# EAGLE design m4_Dev_Board (EAGLE 6.2)
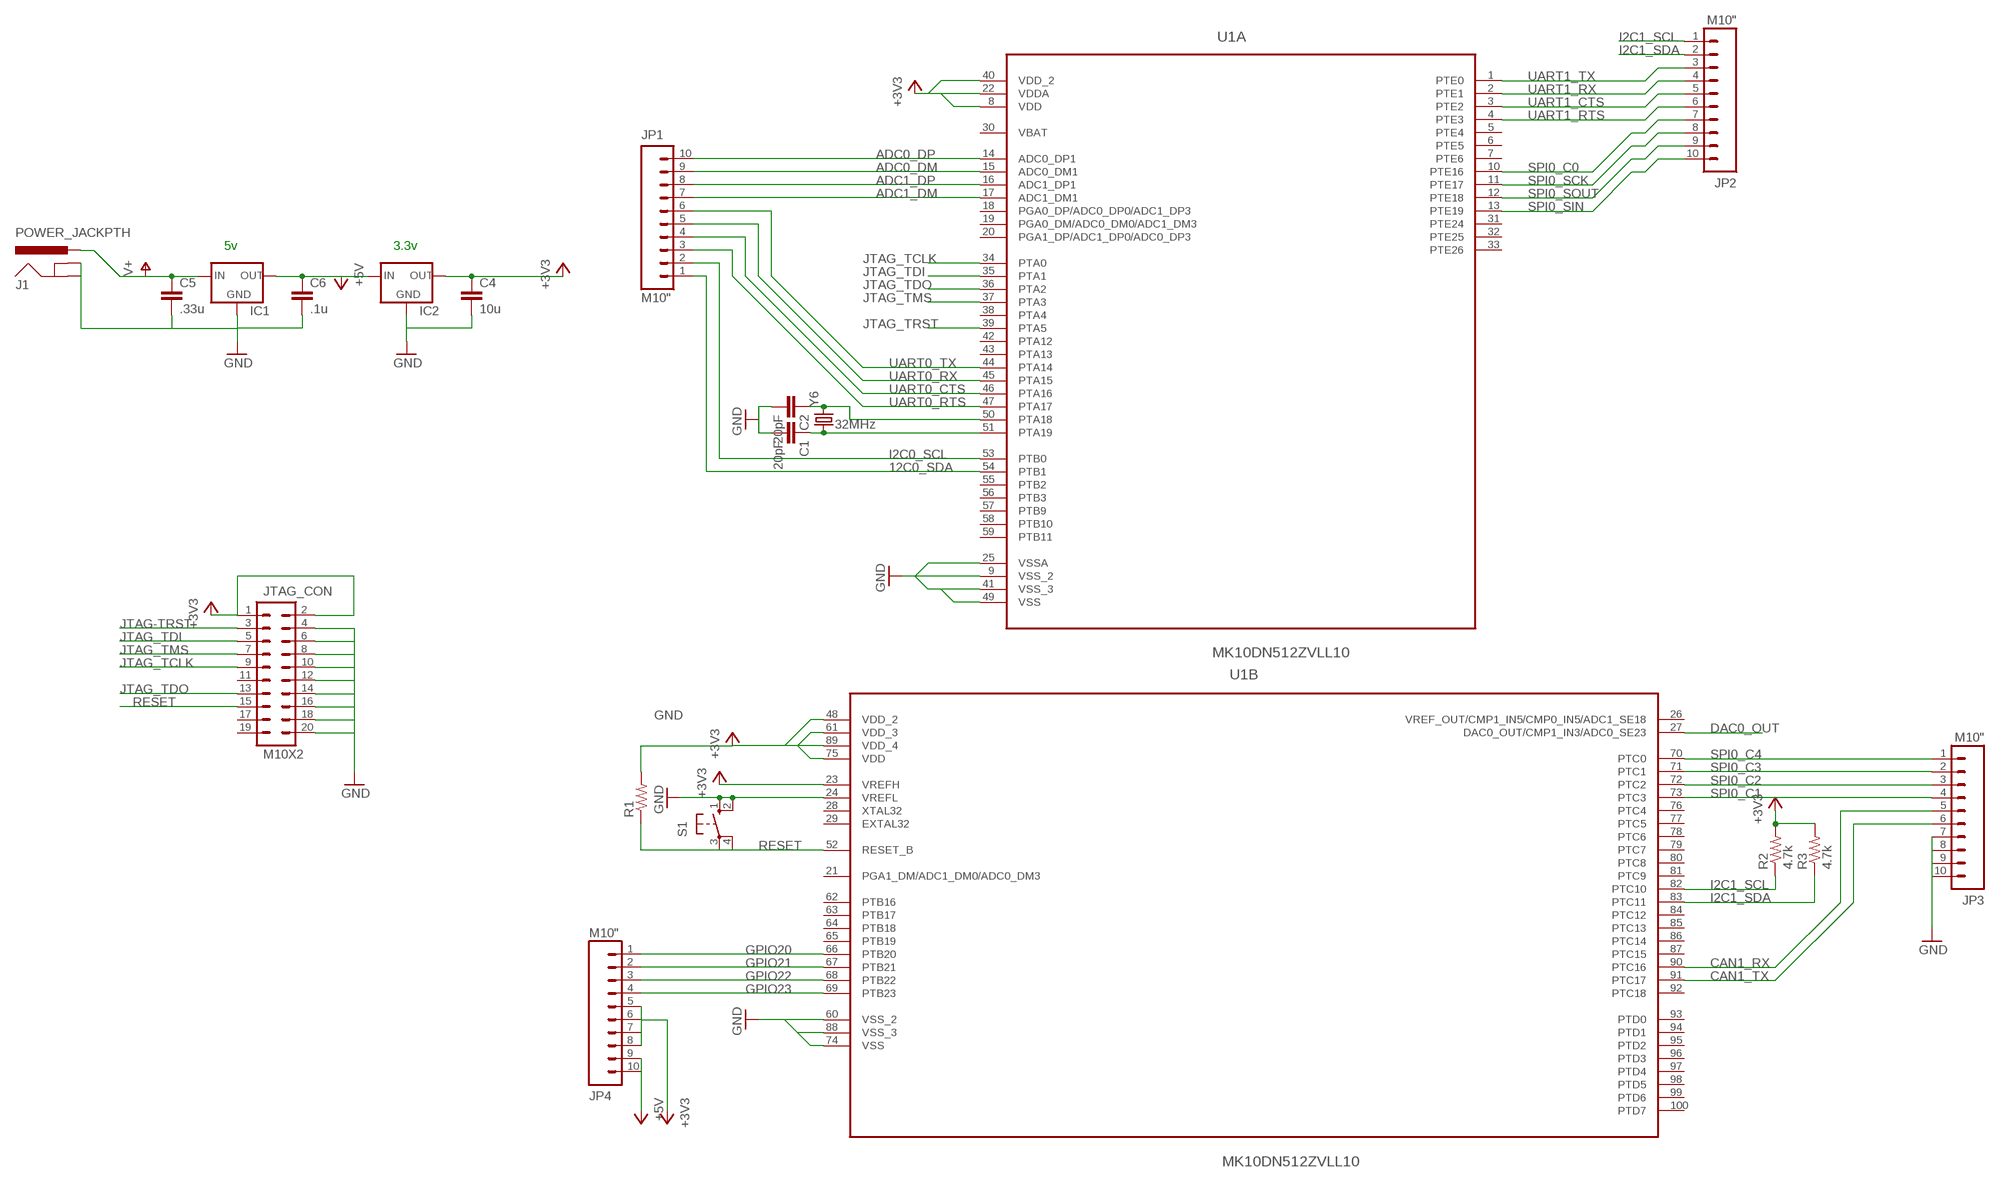
[diagram p0: schematic, sheet 1]

## Parts
C1  20pF  CAPPTH1  [CAP-PTH-5MM]
C2  20pF  CAPPTH1  [CAP-PTH-5MM]
C4  10u  CAPPTH1  [CAP-PTH-5MM]
C5  .33u  CAPPTH1  [CAP-PTH-5MM]
C6  .1u  CAPPTH1  [CAP-PTH-5MM]
IC1  V_REG_78XXSINK  [TO220-IGO]
IC2  V_REG_78XXSINK  [TO220-IGO]
J1  POWER_JACKPTH  [POWER_JACK_PTH]
JP1  M10"  [1X10]
JP2  M10"  [1X10]
JP3  M10"  [1X10]
JP4  M10"  [1X10]
JTAG_CON  M10X2  [2X10]
R1  RESISTORPTH-1/4W  [AXIAL-0.4]
R2  4.7k  RESISTORPTH-1/4W  [AXIAL-0.4]
R3  4.7k  RESISTORPTH-1/4W  [AXIAL-0.4]
S1  10-XX  [B3F-10XX]
U1  MK10DN512ZVLL10  [QFP50P1600X1600X170-100N]
Y6  32MHz  CRYSTAL5X3  [CRYSTAL-SMD-5X3]

## Nets
12C0_SDA: JP1.1 U1.54(A:PTB1)
+3V3: C4.1 IC2.OUT JP4.5 JP4.6 JP4.7 JP4.8 JTAG_CON.1 JTAG_CON.2 R1.P$2 R2.P$2 R3.P$2 U1.8(A:VDD) U1.22(A:VDDA) U1.23(B:VREFH) U1.40(A:VDD_2) U1.48(B:VDD_2) U1.61(B:VDD_3) U1.75(B:VDD) U1.89(B:VDD_4)
+5V: C6.1 IC1.OUT IC2.IN JP4.9 JP4.10
ADC0_DM: JP1.9 U1.15(A:ADC0_DM1)
ADC0_DP: JP1.10 U1.14(A:ADC0_DP1)
ADC1_DM: JP1.7 U1.17(A:ADC1_DM1)
ADC1_DP: JP1.8 U1.16(A:ADC1_DP1)
CAN1_RX: JP3.5 U1.90(B:PTC16)
CAN1_TX: JP3.6 U1.91(B:PTC17)
DAC0_OUT: U1.27(B:DAC0_OUT/CMP1_IN3/ADC0_SE23)
GND: C1.2 C2.2 C4.2 C5.2 C6.2 IC1.GND IC2.GND J1.GND J1.GNDBREAK JP3.7 JP3.8 JP3.9 JP3.10 JTAG_CON.4 JTAG_CON.6 JTAG_CON.8 JTAG_CON.10 JTAG_CON.12 JTAG_CON.14 JTAG_CON.16 JTAG_CON.18 JTAG_CON.20 S1.1(S) S1.2(S1) U1.9(A:VSS_2) U1.24(B:VREFL) U1.25(A:VSSA) U1.41(A:VSS_3) U1.49(A:VSS) U1.60(B:VSS_2) U1.74(B:VSS) U1.88(B:VSS_3)
GPIO20: JP4.1 U1.66(B:PTB20)
GPIO21: JP4.2 U1.67(B:PTB21)
GPIO22: JP4.3 U1.68(B:PTB22)
GPIO23: JP4.4 U1.69(B:PTB23)
I2C0_SCL: JP1.2 U1.53(A:PTB0)
I2C1_SCL: JP2.1 R2.P$1 U1.82(B:PTC10)
I2C1_SDA: JP2.2 R3.P$1 U1.83(B:PTC11)
JTAG-TRST: JTAG_CON.3
JTAG_TCLK: JTAG_CON.9 U1.34(A:PTA0)
JTAG_TDI: JTAG_CON.5 U1.35(A:PTA1)
JTAG_TDO: JTAG_CON.13 U1.36(A:PTA2)
JTAG_TMS: JTAG_CON.7 U1.37(A:PTA3)
JTAG_TRST: U1.39(A:PTA5)
N$8: C2.1 U1.50(A:PTA18) Y6.3
N$9: C1.1 U1.51(A:PTA19) Y6.1
RESET: JTAG_CON.15 R1.P$1 S1.3(P) S1.4(P1) U1.52(B:RESET_B)
SPI0_C0: JP2.7 U1.10(A:PTE16)
SPI0_C1: JP3.4 U1.73(B:PTC3)
SPI0_C2: JP3.3 U1.72(B:PTC2)
SPI0_C3: JP3.2 U1.71(B:PTC1)
SPI0_C4: JP3.1 U1.70(B:PTC0)
SPI0_SCK: JP2.8 U1.11(A:PTE17)
SPI0_SIN: JP2.10 U1.13(A:PTE19)
SPI0_SOUT: JP2.9 U1.12(A:PTE18)
UART0_CTS: JP1.4 U1.46(A:PTA16)
UART0_RTS: JP1.3 U1.47(A:PTA17)
UART0_RX: JP1.5 U1.45(A:PTA15)
UART0_TX: JP1.6 U1.44(A:PTA14)
UART1_CTS: JP2.5 U1.3(A:PTE2)
UART1_RTS: JP2.6 U1.4(A:PTE3)
UART1_RX: JP2.4 U1.2(A:PTE1)
UART1_TX: JP2.3 U1.1(A:PTE0)
V+: C5.1 IC1.IN J1.PWR
Unconnected: JTAG_CON.11 JTAG_CON.17 JTAG_CON.19 U1.5(A:PTE4) U1.6(A:PTE5) U1.7(A:PTE6) U1.18(A:PGA0_DP/ADC0_DP0/ADC1_DP3) U1.19(A:PGA0_DM/ADC0_DM0/ADC1_DM3) U1.20(A:PGA1_DP/ADC1_DP0/ADC0_DP3) U1.21(B:PGA1_DM/ADC1_DM0/ADC0_DM3) U1.26(B:VREF_OUT/CMP1_IN5/CMP0_IN5/ADC1_SE18) U1.28(B:XTAL32) U1.29(B:EXTAL32) U1.31(A:PTE24) U1.32(A:PTE25) U1.33(A:PTE26) U1.38(A:PTA4) U1.42(A:PTA12) U1.43(A:PTA13) U1.55(A:PTB2) U1.56(A:PTB3) U1.57(A:PTB9) U1.58(A:PTB10) U1.59(A:PTB11) U1.62(B:PTB16) U1.63(B:PTB17) U1.64(B:PTB18) U1.65(B:PTB19) U1.76(B:PTC4) U1.77(B:PTC5) U1.78(B:PTC6) U1.79(B:PTC7) U1.80(B:PTC8) U1.81(B:PTC9) U1.84(B:PTC12) U1.85(B:PTC13) U1.86(B:PTC14) U1.87(B:PTC15) U1.92(B:PTC18) U1.93(B:PTD0) U1.94(B:PTD1) U1.95(B:PTD2) U1.96(B:PTD3) U1.97(B:PTD4) U1.98(B:PTD5) U1.99(B:PTD6) U1.100(B:PTD7)

## Notes on the sheet
- 5v | 3.3v

## Power pins joined to a net without a drawn wire
VBAT: U1.30(A:VBAT)

## Library data of the parts
C1 C2 C4-C6 = SparkFun-Passives:CAP: Capacitor Standard 0603 ceramic capacitor, and 0.1" leaded capacitor.
IC1 IC2 = SparkFun-PowerIC:V_REG_78XX: Voltage Regulator Standard 7805 5V regulator. IGO (Input Ground Output). Spark Fun Electronics SKU : COM-00107
J1 = SparkFun-Connectors:POWER_JACK: Power Jack This is the standard 5.5mm barrel jack for power. The PTH is the most common, proven, reliable, footprint. The Slot footprint only works if the mill layer is transmitted to the PCB fab house so be warned. Spark Fun Electronics SKU : PRT-00119 SMT: CONN-08106 Mating wall wart : TOL-00298 (and others)
JP1-JP4 = SparkFun-Connectors:M10: Header 10 Standard 10-pin 0.1" header. Use with straight break away headers (SKU : PRT-00116), right angle break away headers (PRT-00553), swiss pins (PRT-00743), machine pins (PRT-00117), and female headers (PRT-00115).
JTAG_CON = SparkFun-Connectors:M10X2: This was SPECIALLY designed to be used with our Graphic LCD Backpack. Be sure you want to use this! It is not only staggered on each line of header holes, but IT IS ALSO offset of the center point of the top and bottom lines by 5 mil. This causes the headers to lock into place on the "standard" footprint on the LCD screen. The extra squares on the tdocu layer are there simply to reference other pins (if you were to actually populate a longer header than ten long - this is what we do with the backpacks).
R1-R3 = SparkFun-Resistors:RESISTOR: Resistor Basic schematic elements and footprints for 0603, 1206, and PTH resistors.
S1 = switch-omron:10-XX: OMRON SWITCH; MPN: B3F-1000; OC_FARNELL: 176432; OC_NEWARK: 36M3542
U1 = freescale_lqfp_m4:MK10DN512ZVLL10: MCU, 32 BIT, KINETIS, K10, LQFP-100; MPN: MK10DN512ZVLL10; OC_FARNELL: 2070276; OC_NEWARK: 75T7577; PACKAGE: LQFP-100; SUPPLIER: FREESCALE SEMICONDUCTOR
Y6 = SparkFun-FreqCtrl:CRYSTAL: Various standard crystals. Proven footprints. Spark Fun Electronics SKU : COM-00534

## Board
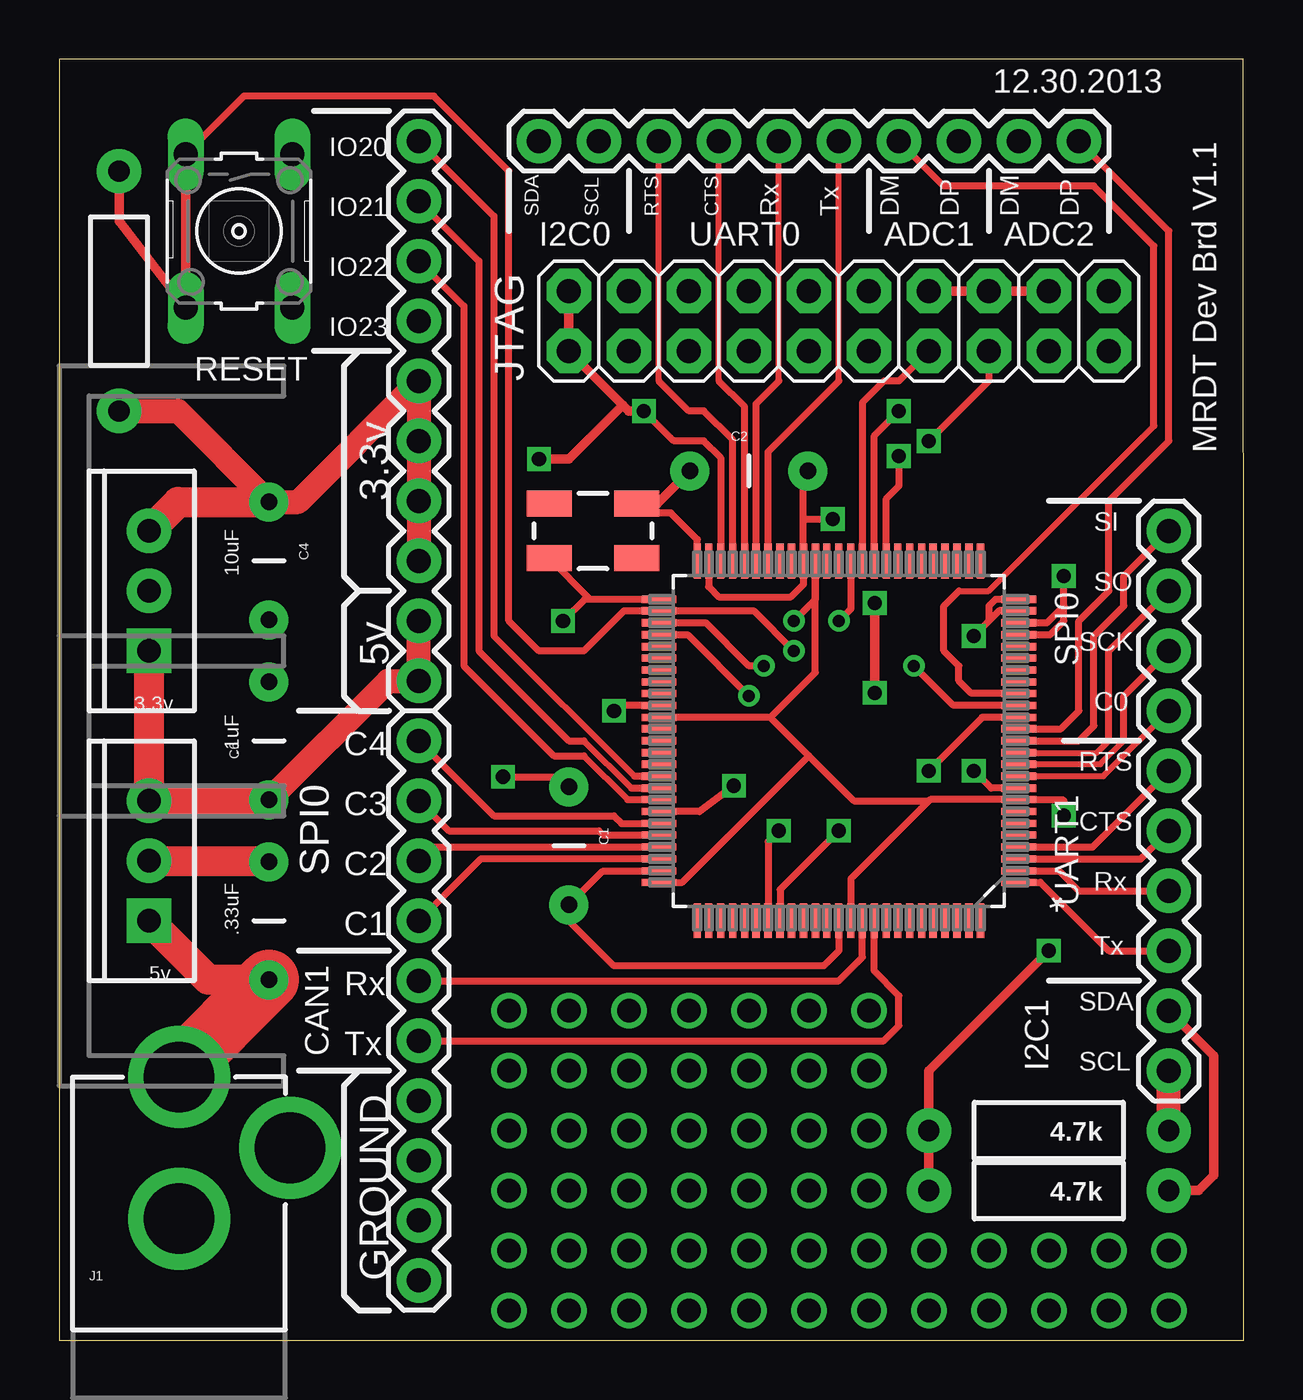
[diagram p1: board, top side]
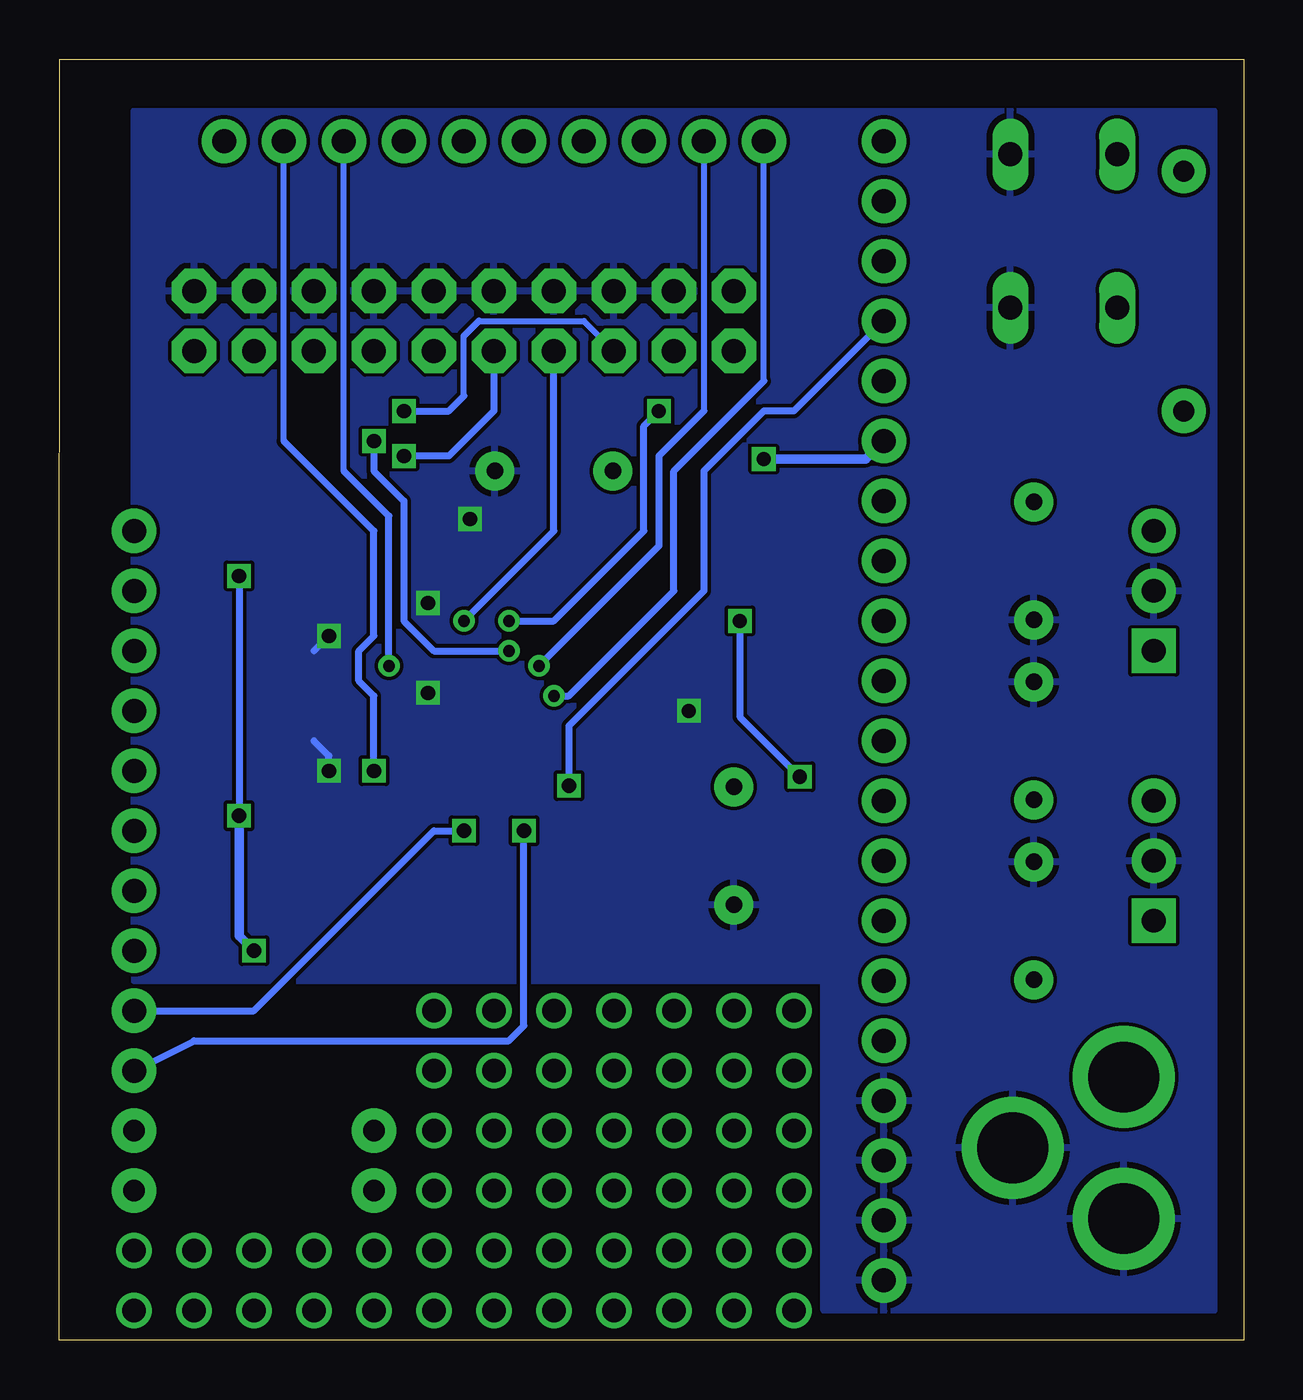
[diagram p2: board, bottom side, seen from below]

Size 50.16 x 54.28 mm. Coordinates in mm from the lower left corner, seen from the top.
Outline: 0,0 50.16,0 50.16,20.95 50.15,54.28 0,54.28 0,0
Copper layers (1*16): Top 0.035mm / dielectric 1.5mm / Bottom 0.035mm
Design rules: minimum track width 10mil, minimum drill 15mil, track to track 6mil, track to pad 8mil, pad to pad 8mil, via to via 8mil, smd to smd 6mil, copper to edge 40mil, drill to drill 8mil, minimum pad ring 10mil, minimum via ring 8mil, stop-mask expansion 4mil, vias tented up to drill 0mil, thermal gap 10mil

### Footprints (pad centres in the part's own frame; a part is rotated, then mirrored left to right if it is on the bottom)
CAP-PTH-5MM = drill 0.7 pad 1.651: 1 -2.5,0; 2 2.5,0
TO220-IGO = drill 1 pad 1.88: GND 0,0; OUT 2.54,0 | drill 1 pad 1.88 square: IN -2.54,0
POWER_JACK_PTH = drill 2.997 pad 4.318: GND 0,7.7; GNDBREAK 4.7,10.7; PWR 0,13.7
1X10 = drill 1.016 pad 1.88: 1 0,0; 2 2.54,0; 3 5.08,0; 4 7.62,0; 5 10.16,0; 6 12.7,0; 7 15.24,0; 8 17.78,0; 9 20.32,0; 10 22.86,0
2X10 = drill 1.016 pad 1.88 octagon: 1 -11.43,-1.27; 2 -11.43,1.27; 3 -8.89,-1.27; 4 -8.89,1.27; 5 -6.35,-1.27; 6 -6.35,1.27; 7 -3.81,-1.27; 8 -3.81,1.27; 9 -1.27,-1.27; 10 -1.27,1.27; 11 1.27,-1.27; 12 1.27,1.27; 13 3.81,-1.27; 14 3.81,1.27; 15 6.35,-1.27; 16 6.35,1.27; 17 8.89,-1.27; 18 8.89,1.27; 19 11.43,-1.27; 20 11.43,1.27
AXIAL-0.4 = drill 0.9 pad 1.88: P$1 -5.08,0; P$2 5.08,0
B3F-10XX = drill 1.016 long: 1 -3.251,2.261; 2 3.251,2.261; 3 -3.251,-2.261; 4 3.251,-2.261
QFP50P1600X1600X170-100N = smd 1.473 x 0.305: 1 -7.62,5.994; 2 -7.62,5.512; 3 -7.62,5.004; 4 -7.62,4.496; 5 -7.62,3.988; 6 -7.62,3.505; 7 -7.62,2.997; 8 -7.62,2.489; 9 -7.62,2.007; 10 -7.62,1.499; 11 -7.62,0.991; 12 -7.62,0.508; 13 -7.62,0; 14 -7.62,-0.508; 15 -7.62,-0.991; 16 -7.62,-1.499; 17 -7.62,-2.007; 18 -7.62,-2.489; 19 -7.62,-2.997; 20 -7.62,-3.505; 21 -7.62,-3.988; 22 -7.62,-4.496; 23 -7.62,-5.004; 24 -7.62,-5.512; 25 -7.62,-5.994; 51 7.62,-5.994; 52 7.62,-5.512; 53 7.62,-5.004; 54 7.62,-4.496; 55 7.62,-3.988; 56 7.62,-3.505; 57 7.62,-2.997; 58 7.62,-2.489; 59 7.62,-2.007; 60 7.62,-1.499; 61 7.62,-0.991; 62 7.62,-0.508; 63 7.62,0; 64 7.62,0.508; 65 7.62,0.991; 66 7.62,1.499; 67 7.62,2.007; 68 7.62,2.489; 69 7.62,2.997; 70 7.62,3.505; 71 7.62,3.988; 72 7.62,4.496; 73 7.62,5.004; 74 7.62,5.512; 75 7.62,5.994 | smd 0.305 x 1.473: 26 -5.994,-7.62; 27 -5.512,-7.62; 28 -5.004,-7.62; 29 -4.496,-7.62; 30 -3.988,-7.62; 31 -3.505,-7.62; 32 -2.997,-7.62; 33 -2.489,-7.62; 34 -2.007,-7.62; 35 -1.499,-7.62; 36 -0.991,-7.62; 37 -0.508,-7.62; 38 0,-7.62; 39 0.508,-7.62; 40 0.991,-7.62; 41 1.499,-7.62; 42 2.007,-7.62; 43 2.489,-7.62; 44 2.997,-7.62; 45 3.505,-7.62; 46 3.988,-7.62; 47 4.496,-7.62; 48 5.004,-7.62; 49 5.512,-7.62; 50 5.994,-7.62; 76 5.994,7.62; 77 5.512,7.62; 78 5.004,7.62; 79 4.496,7.62; 80 3.988,7.62; 81 3.505,7.62; 82 2.997,7.62; 83 2.489,7.62; 84 2.007,7.62; 85 1.499,7.62; 86 0.991,7.62; 87 0.508,7.62; 88 0,7.62; 89 -0.508,7.62; 90 -0.991,7.62; 91 -1.499,7.62; 92 -2.007,7.62; 93 -2.489,7.62; 94 -2.997,7.62; 95 -3.505,7.62; 96 -3.988,7.62; 97 -4.496,7.62; 98 -5.004,7.62; 99 -5.512,7.62; 100 -5.994,7.62
CRYSTAL-SMD-5X3 = smd 1.9 x 1.1: 1 -1.85,-1.15; 2 1.85,-1.15; 3 1.85,1.15; 4 -1.85,1.15

### Placement (x,y rotation side)
C1  21.59,20.95 270 top
C2  29.21,36.83 0 top
C4  8.89,33.02 270 top
C5  8.89,17.78 90 top
C6  8.89,25.4 90 top
IC1  3.81,20.32 90 top
IC2  3.81,31.75 90 top
J1  5.08,-2.54 0 top
JP1  20.32,50.8 0 top
JP2  46.99,11.43 90 top
JP3  15.24,25.4 270 top
JP4  15.24,50.8 270 top
JTAG_CON  33.02,43.18 0 top
R1  2.54,44.45 270 top
R2  41.91,8.89 180 top
R3  41.91,6.35 180 top
S1  7.62,46.99 270 top
U1  33.02,25.4 180 top
Y6  22.61,34.29 0 top

### Tracks (layer width: path | path; a pad name or v marks a point on that pad's centre or on a via)
12C0_SDA  (via drill 0.5 pad 0.3)
  Top 0.305: U1.54 26.62,29.9 v29.21,27.3
  Bottom 0.254: 20.32,40.64 JP1.1
  Bottom 0.305: v29.21,27.3 28.57,27.3 24.13,31.75 24.13,36.83 20.32,40.64
+3V3  (via drill 0.5, 0.6)
  Top 0.305: 36.83,22.86 33.53,19.56 U1.89 | 36.83,22.86 33.66,22.86 31.75,24.77 | U1.48 28.02,37.39 27.3,38.1 26.04,38.1 v24.77,39.37 | 31.75,24.77 30.12,26.39 | 30.12,26.39 U1.61 | 30.12,26.39 32.03,28.3 U1.40 32.03,31.39 v31.11,30.48 | U1.22 41.96,29.9 42.55,30.48 42.55,31.11 | U1.23 41.83,30.4 42.55,31.11 | 42.55,31.11 v42.55,32.38 | v42.55,22.22 42.55,22.86 42.49,22.91 U1.8 36.88,22.91 36.83,22.86 | U1.75 26.39,19.41 31.75,24.77
  Top 0.406: R3.P$2 R2.P$2 36.83,11.43 v41.91,16.51 | JTAG_CON.2 JTAG_CON.1 23.88,39.62 | 23.88,39.62 24.13,39.37 v24.77,39.37 | v20.32,37.34 21.59,37.34 23.88,39.62
  Top 1.016: JP4.8 JP4.7 JP4.6 JP4.5 10.12,35.52 C4.1 5.04,39.37 R1.P$2
  Top 1.27: IC2.OUT 5.04,35.52 C4.1
  Bottom 0.305: v42.55,32.38 v42.55,22.22 | v31.11,30.48 29.21,30.48 25.4,34.29 25.4,38.74 v24.77,39.37
  Bottom 0.406: v41.91,16.51 42.55,17.14 v42.55,22.22 | v20.32,37.34 16,37.34 JP4.6
+5V
  Top 1.016: C6.1 13.93,27.94 JP4.10 JP4.9
  Top 1.27: IC2.IN IC1.OUT 8.85,22.86 C6.1
ADC0_DM  (via drill 0.6 pad 0.81)
  Top 0.305: U1.15 39.09,26.39 v36.83,24.13
  Bottom 0.254: 40.64,38.1 JP1.9
  Bottom 0.305: 40.64,38.1 36.83,34.29 36.83,29.84 37.47,29.21 37.47,27.94 36.83,27.3 v36.83,24.13
ADC0_DP
  Top 0.305: U1.14 42.42,25.91 43.18,26.67 43.18,30.48 44.45,31.75 44.45,35.56 46.99,38.1 46.99,46.99 JP1.10
ADC1_DM
  Top 0.254: 38.1,31.75 39.37,31.75 46.35,38.74
  Top 0.305: 46.35,38.74 46.35,46.36 43.81,48.9 37.47,48.9 JP1.7 | U1.17 38.63,27.41 38.1,27.94 38.1,28.57 37.47,29.21 37.47,31.11 38.1,31.75
ADC1_DP  (via drill 0.5 pad 0.41)
  Top 0.305: U1.16 37.87,26.9 v36.2,28.57
  Bottom 0.254: 38.1,36.83 JP1.8
  Bottom 0.305: 38.1,36.83 36.2,34.93 v36.2,28.57
CAN1_RX
  Top 0.305: JP3.5 33.02,15.24 34.01,16.23 U1.90
CAN1_TX
  Top 0.305: JP3.6 34.92,12.7 35.56,13.33 35.56,14.61 34.52,15.65 U1.91
GND  (via drill 0.6)
  Top 0.305: C2.2 31.52,36.64 U1.41 31.52,32.03 30.99,31.5 27.94,31.5 27.51,31.93 U1.49 | U1.74 23.02,19.89 C1.2 21.59,17.78 23.5,15.88 32.38,15.88 33.02,16.51 U1.88 | U1.25 39.65,31.39 39.37,31.11 39.37,30.48 | 39.37,30.48 v38.73,29.84 | U1.24 39.8,30.91 39.37,30.48 | U1.9 39.47,23.39 v38.73,24.13 | U1.60 23.72,26.9 v23.5,26.67 | 31.5,34.8 v32.77,34.8
  Top 0.406: JTAG_CON.14 JTAG_CON.16 JTAG_CON.18 | v34.54,31.24 v34.54,27.43
  Top 1.27: IC1.GND 8.85,20.32 C5.2
  Bottom 0.305: v38.73,29.84 39.37,29.21 | v38.73,24.13 38.73,24.77 39.37,25.4
  pour Bottom: 1.27,1.27 17.78,1.27 17.78,15.24 46.99,15.24 46.99,52.07 1.27,52.07
GPIO20
  Top 0.254: 18.41,29.84 24.36,23.9
  Top 0.305: JP4.1 18.41,47.62 18.41,29.84 | 24.36,23.9 U1.66
GPIO21
  Top 0.254: 22.23,25.4 24.23,23.39
  Top 0.305: JP4.2 17.78,45.72 17.78,29.21 21.59,25.4 22.23,25.4 | 24.23,23.39 U1.67
GPIO22
  Top 0.254: 22.23,24.77 24.08,22.91
  Top 0.305: JP4.3 17.14,43.82 17.14,28.57 20.95,24.77 22.23,24.77 | 24.08,22.91 U1.68
GPIO23  (via drill 0.6 pad 0.3)
  Top 0.305: v28.57,23.5 27.13,22.4 U1.69
  Bottom 0.305: JP4.4 19.05,39.37 20.32,39.37 22.86,36.83 22.86,31.75 28.57,26.04 v28.57,23.5
I2C0_SCL  (via drill 0.5 pad 0.3)
  Top 0.305: v29.84,28.57 29.21,28.57 27.38,30.4 U1.53
  Bottom 0.254: JP1.2 22.86,39.37
  Bottom 0.305: 22.86,39.37 24.77,37.47 24.77,33.66 v29.84,28.57
I2C1_SCL  (via drill 0.6 pad 0.3)
  Top 0.305: v30.48,21.59 30.02,21.13 U1.82
  Top 1.016: R2.P$1 JP2.1
  Bottom 0.305: JP2.1 44.45,12.7 31.11,12.7 30.48,13.33 v30.48,21.59
I2C1_SDA  (via drill 0.6 pad 0.3)
  Top 0.305: v33.02,21.59 30.53,19.1 U1.83
  Top 0.406: R3.P$1 48.26,6.35 48.9,6.98 48.9,12.06 JP2.2
  Bottom 0.305: JP2.2 41.91,13.97 34.29,21.59 v33.02,21.59
JTAG_TCLK  (via drill 0.6 pad 0.3)
  Top 0.305: v35.56,37.47 35.56,36.2 35.03,35.66 U1.34
  Bottom 0.305: JTAG_CON.9 31.75,39.37 33.66,37.47 v35.56,37.47
JTAG_TDI  (via drill 0.6 pad 0.3)
  Top 0.305: U1.35 34.52,38.33 v35.56,39.37
  Bottom 0.254: 33.02,40.01 33.02,42.55 | 32.38,43.18 27.94,43.18 JTAG_CON.5
  Bottom 0.305: v35.56,39.37 33.66,39.37 33.02,40.01 | 33.02,42.55 32.38,43.18
JTAG_TDO
  Top 0.305: JTAG_CON.13 35.56,40.64 34.92,40.64 34.01,39.73 U1.36
JTAG_TMS  (via drill 0.5 pad 0.3)
  Top 0.305: U1.37 33.53,30.99 v33.02,30.48
  Bottom 0.305: v33.02,30.48 29.21,34.29 JTAG_CON.7
N$1  (via drill 1 pad 0.81)
  other vias: 19.05,13.97
N$2  (via drill 1 pad 0.81)
  other vias: 21.59,13.97
N$3  (via drill 1 pad 0.81)
  other vias: 24.13,13.97
N$4  (via drill 1 pad 0.81)
  other vias: 26.67,13.97
N$5  (via drill 1 pad 0.81)
  other vias: 29.21,13.97
N$6  (via drill 1 pad 0.81)
  other vias: 31.75,13.97
N$7  (via drill 1 pad 0.81)
  other vias: 34.29,13.97
N$8
  Top 0.305: U1.50 27.03,33.93 25.91,35.05 24.84,35.05 Y6.3
  Top 0.406: Y6.3 25.32,35.44 C2.1
N$9  (via drill 0.6)
  Top 0.305: U1.51 22.5,31.39 | 22.5,31.39 Y6.1 | 22.5,31.39 22.25,31.39 v21.34,30.48 | v18.8,23.88 21.17,23.88 C1.1
  Bottom 0.305: v21.34,30.48 21.34,26.42 v18.8,23.88
N$11  (via drill 1 pad 0.81)
  other vias: 19.05,11.43
N$12  (via drill 1 pad 0.81)
  other vias: 21.59,11.43
N$13  (via drill 1 pad 0.81)
  other vias: 24.13,11.43
N$14  (via drill 1 pad 0.81)
  other vias: 26.67,11.43
N$15  (via drill 1 pad 0.81)
  other vias: 29.21,11.43
N$16  (via drill 1 pad 0.81)
  other vias: 31.75,11.43
N$17  (via drill 1 pad 0.81)
  other vias: 34.29,11.43
N$21  (via drill 1 pad 0.81)
  other vias: 19.05,8.89
N$22  (via drill 1 pad 0.81)
  other vias: 21.59,8.89
N$23  (via drill 1 pad 0.81)
  other vias: 24.13,8.89
N$24  (via drill 1 pad 0.81)
  other vias: 26.67,8.89
N$25  (via drill 1 pad 0.81)
  other vias: 29.21,8.89
N$26  (via drill 1 pad 0.81)
  other vias: 31.75,8.89
N$27  (via drill 1 pad 0.81)
  other vias: 34.29,8.89
N$31  (via drill 1 pad 0.81)
  other vias: 19.05,6.35
N$32  (via drill 1 pad 0.81)
  other vias: 21.59,6.35
N$33  (via drill 1 pad 0.81)
  other vias: 24.13,6.35
N$34  (via drill 1 pad 0.81)
  other vias: 26.67,6.35
N$35  (via drill 1 pad 0.81)
  other vias: 29.21,6.35
N$36  (via drill 1 pad 0.81)
  other vias: 31.75,6.35
N$37  (via drill 1 pad 0.81)
  other vias: 34.29,6.35
N$41  (via drill 1 pad 0.81)
  other vias: 19.05,3.81
N$42  (via drill 1 pad 0.81)
  other vias: 21.59,3.81
N$43  (via drill 1 pad 0.81)
  other vias: 24.13,3.81
N$44  (via drill 1 pad 0.81)
  other vias: 26.67,3.81
N$45  (via drill 1 pad 0.81)
  other vias: 29.21,3.81
N$46  (via drill 1 pad 0.81)
  other vias: 31.75,3.81
N$47  (via drill 1 pad 0.81)
  other vias: 34.29,3.81
N$48  (via drill 1 pad 0.81)
  other vias: 36.83,3.81
N$49  (via drill 1 pad 0.81)
  other vias: 39.37,3.81
N$50  (via drill 1 pad 0.81)
  other vias: 41.91,3.81
N$51  (via drill 1 pad 0.81)
  other vias: 19.05,1.27
N$52  (via drill 1 pad 0.81)
  other vias: 21.59,1.27
N$53  (via drill 1 pad 0.81)
  other vias: 24.13,1.27
N$54  (via drill 1 pad 0.81)
  other vias: 26.67,1.27
N$55  (via drill 1 pad 0.81)
  other vias: 29.21,1.27
N$56  (via drill 1 pad 0.81)
  other vias: 31.75,1.27
N$57  (via drill 1 pad 0.81)
  other vias: 34.29,1.27
N$58  (via drill 1 pad 0.81)
  other vias: 36.83,1.27
N$59  (via drill 1 pad 0.81)
  other vias: 39.37,1.27
N$60  (via drill 1 pad 0.81)
  other vias: 41.91,1.27
N$67  (via drill 1 pad 0.81)
  other vias: 44.45,3.81
N$68  (via drill 1 pad 0.81)
  other vias: 46.99,3.81
N$69  (via drill 1 pad 0.81)
  other vias: 44.45,1.27
N$70  (via drill 1 pad 0.81)
  other vias: 46.99,1.27
RESET  (via drill 0.5 pad 0.3, 0.6 pad 0.3)
  Top 0.305: JTAG_CON.15 39.37,40.64 v36.83,38.1 | S1.3 7.82,52.71 15.88,52.71 19.05,49.53 19.05,30.48 20.32,29.21 22.23,29.21 23.93,30.91 U1.52 29.41,30.91 v31.11,29.21
  Top 0.406: R1.P$1 2.54,47.42 S1.4 S1.3
  Bottom 0.305: v36.83,38.1 36.83,36.83 35.56,35.56 35.56,30.48 34.29,29.21 v31.11,29.21
SPI0_C0
  Top 0.254: U1.10 44.22,23.9 JP2.7
SPI0_C1
  Top 0.305: JP3.4 17.86,20.4 U1.73
SPI0_C2
  Top 0.305: JP3.3 15.82,20.9 U1.72
SPI0_C3
  Top 0.305: JP3.2 16.51,21.59 22.86,21.59 23.04,21.41 U1.71
SPI0_C4
  Top 0.305: JP3.1 18.41,22.22 23.5,22.22 23.82,21.89 U1.70
SPI0_SCK
  Top 0.254: U1.11 44.09,24.41 45.09,25.4
  Top 0.305: 45.09,25.4 45.09,27.3 JP2.8
SPI0_SIN
  Top 0.305: U1.13 43.18,25.4 43.81,26.04 43.81,29.84 45.09,31.11 45.09,32.38 JP2.10
SPI0_SOUT
  Top 0.254: U1.12 43.94,24.89 44.45,25.4
  Top 0.305: 44.45,25.4 44.45,29.21 JP2.9
UART0_CTS
  Top 0.254: 27.94,40.64 JP1.4
  Top 0.305: U1.46 29.03,39.55 27.94,40.64
UART0_RTS
  Top 0.254: 25.4,40.64 JP1.3
  Top 0.305: U1.47 28.52,38.15 27.3,39.37 26.67,39.37 25.4,40.64
UART0_RX
  Top 0.254: 30.48,40.64 JP1.5
  Top 0.305: U1.45 29.52,39.68 30.48,40.64
UART0_TX
  Top 0.254: 33.02,40.64 JP1.6
  Top 0.305: U1.44 30.02,37.64 33.02,40.64
UART1_CTS
  Top 0.305: U1.3 45.8,20.4 JP2.5
UART1_RTS
  Top 0.305: U1.4 43.76,20.9 JP2.6
UART1_RX
  Top 0.305: U1.2 42.34,19.89 43.18,19.05 JP2.4
UART1_TX
  Top 0.305: U1.1 41.55,19.41 44.45,16.51 JP2.3
V+
  Top 1.27: C5.1 6.31,15.28 IC1.IN
  Top 2.54: J1.PWR 5.08,11.47 C5.1

### Text on the board
tPlace: 12.30.2013 | MRDT Dev Brd V1.1
_tsilk: IO20 | IO21 | SDA | SCL | RTS | CTS | Rx | Tx | DM | DP | DM | DP | I2C0 | UART0 | ADC1 | ADC2 | IO22 | IO23 | RESET | JTAG | 3.3v | SI | 10uF | SO | SCK | 5v | SPI0 | 3.3v | C0 | .1uF | C4 | RTS | C3 | CTS | SPI0 | C2 | Rx | UART1 | .33uF | C1 | Tx | 5v | Rx | SDA | CAN1 | Tx | I2C1 | SCL | GROUND